# Altium schematic sheet MotorController_ControlV1.1.SchDoc
size 889 x 508 mm
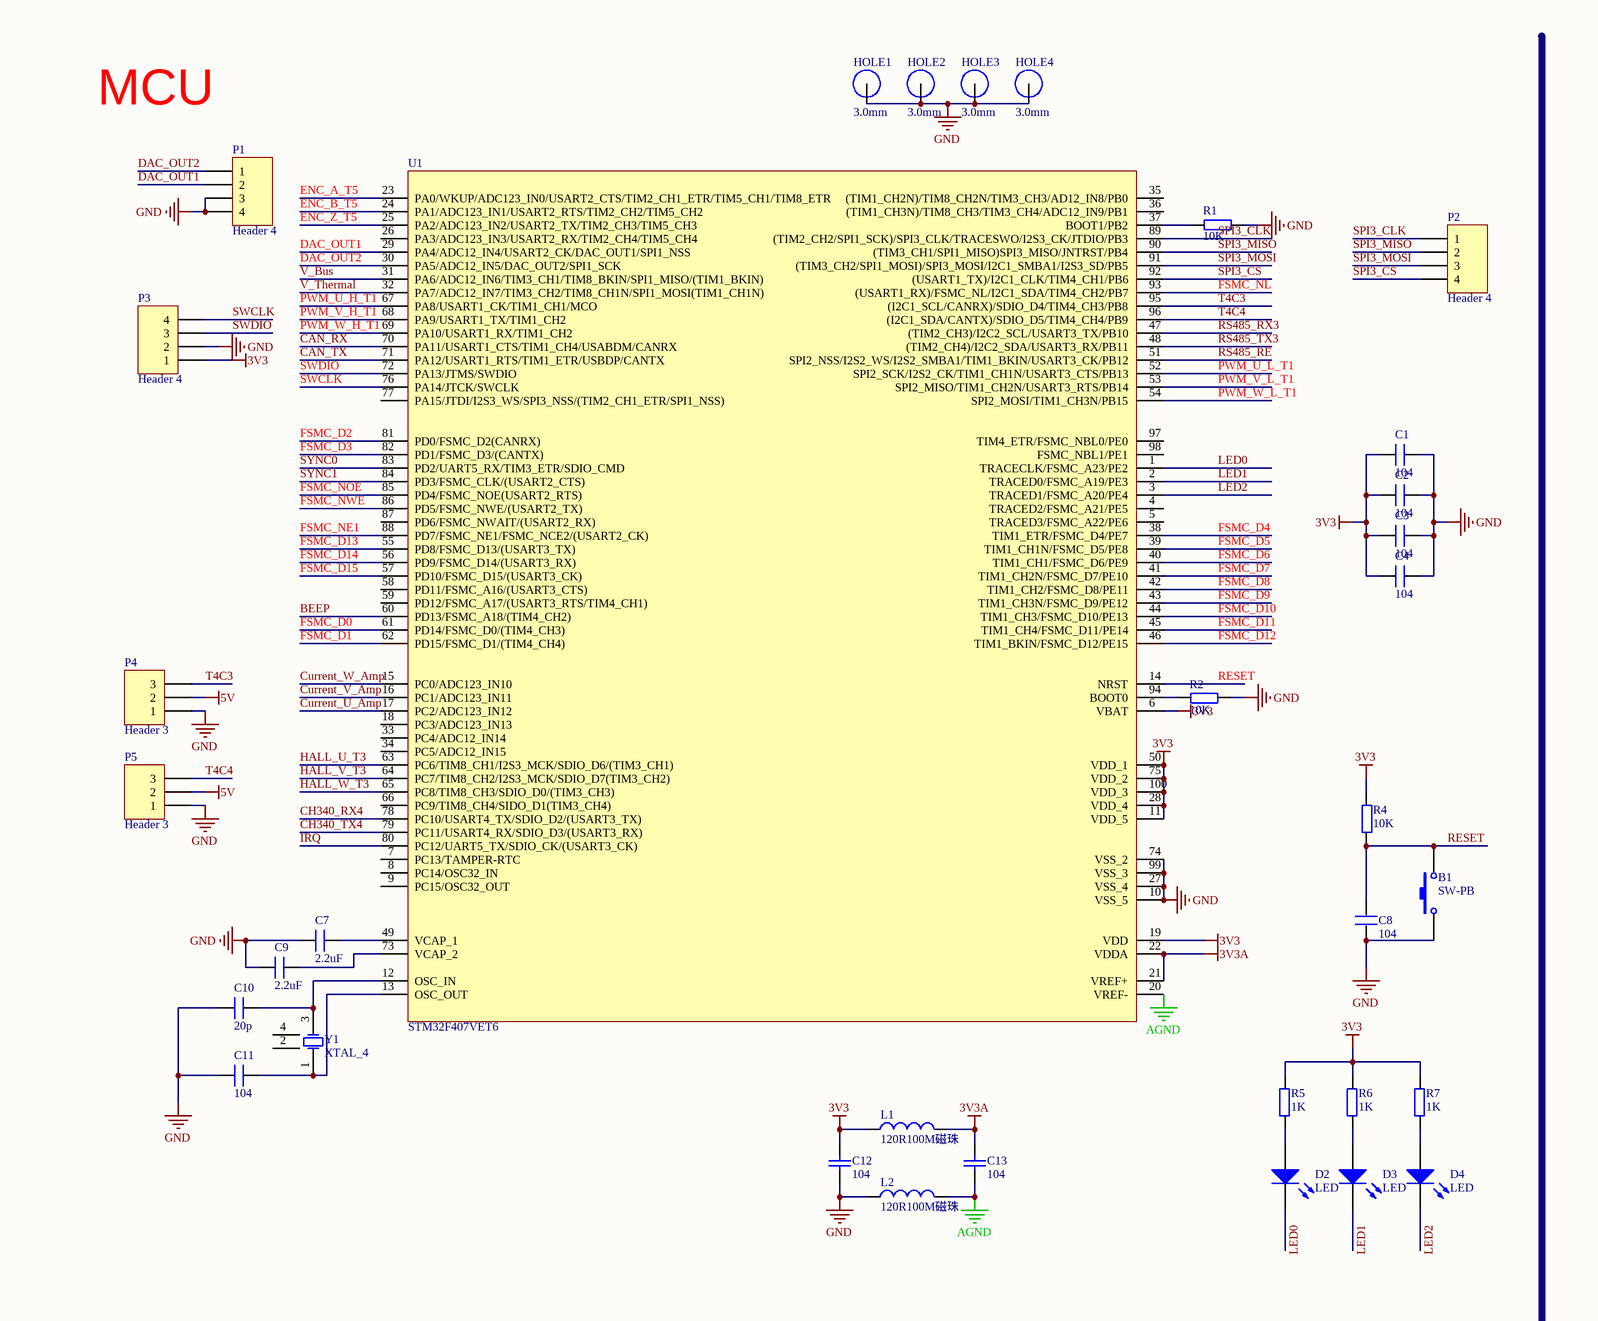
[diagram p0: MotorController_ControlV1.1.SchDoc, top left]
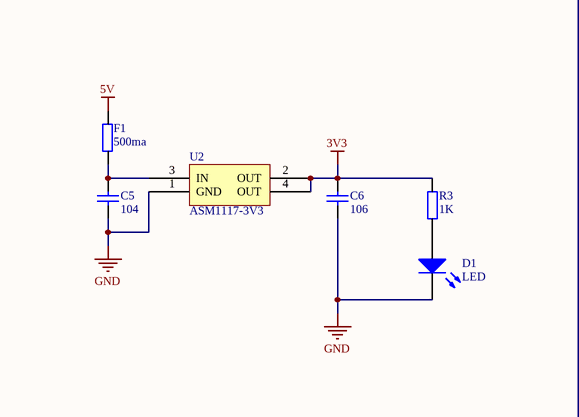
[diagram p1: MotorController_ControlV1.1.SchDoc, top middle]
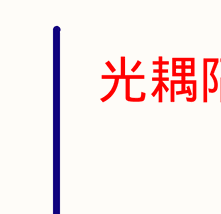
[diagram p2: MotorController_ControlV1.1.SchDoc, top right]
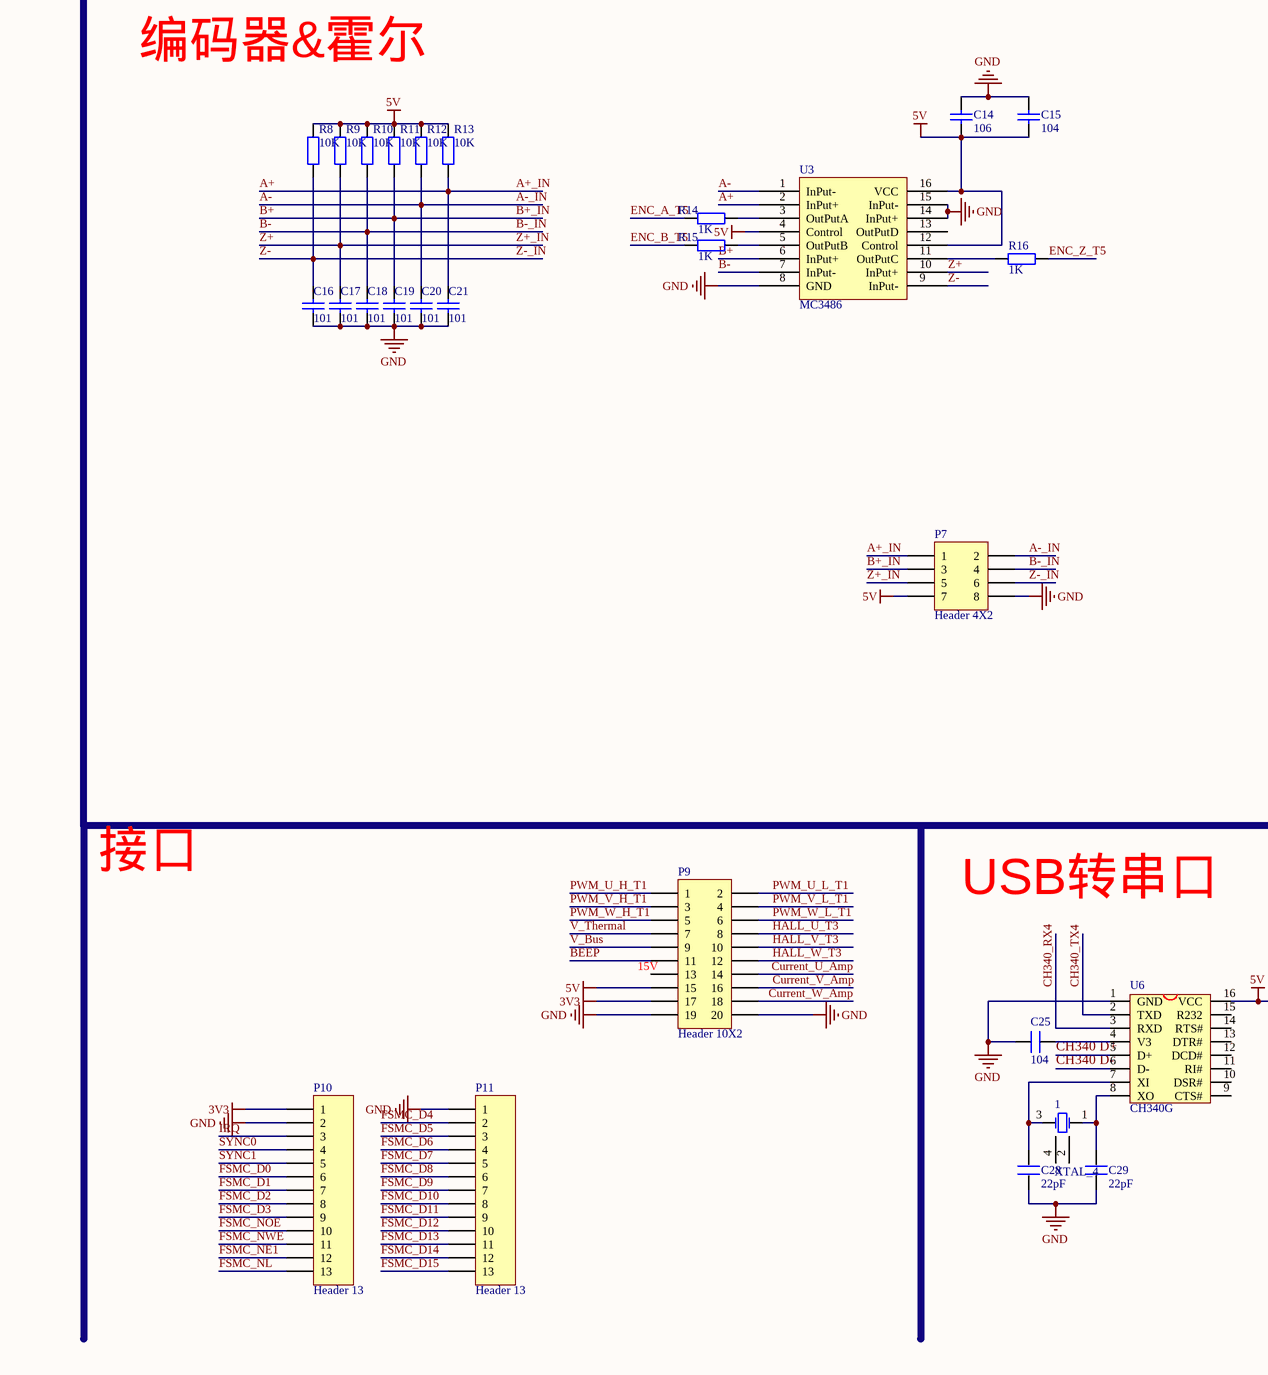
[diagram p3: MotorController_ControlV1.1.SchDoc, bottom middle]
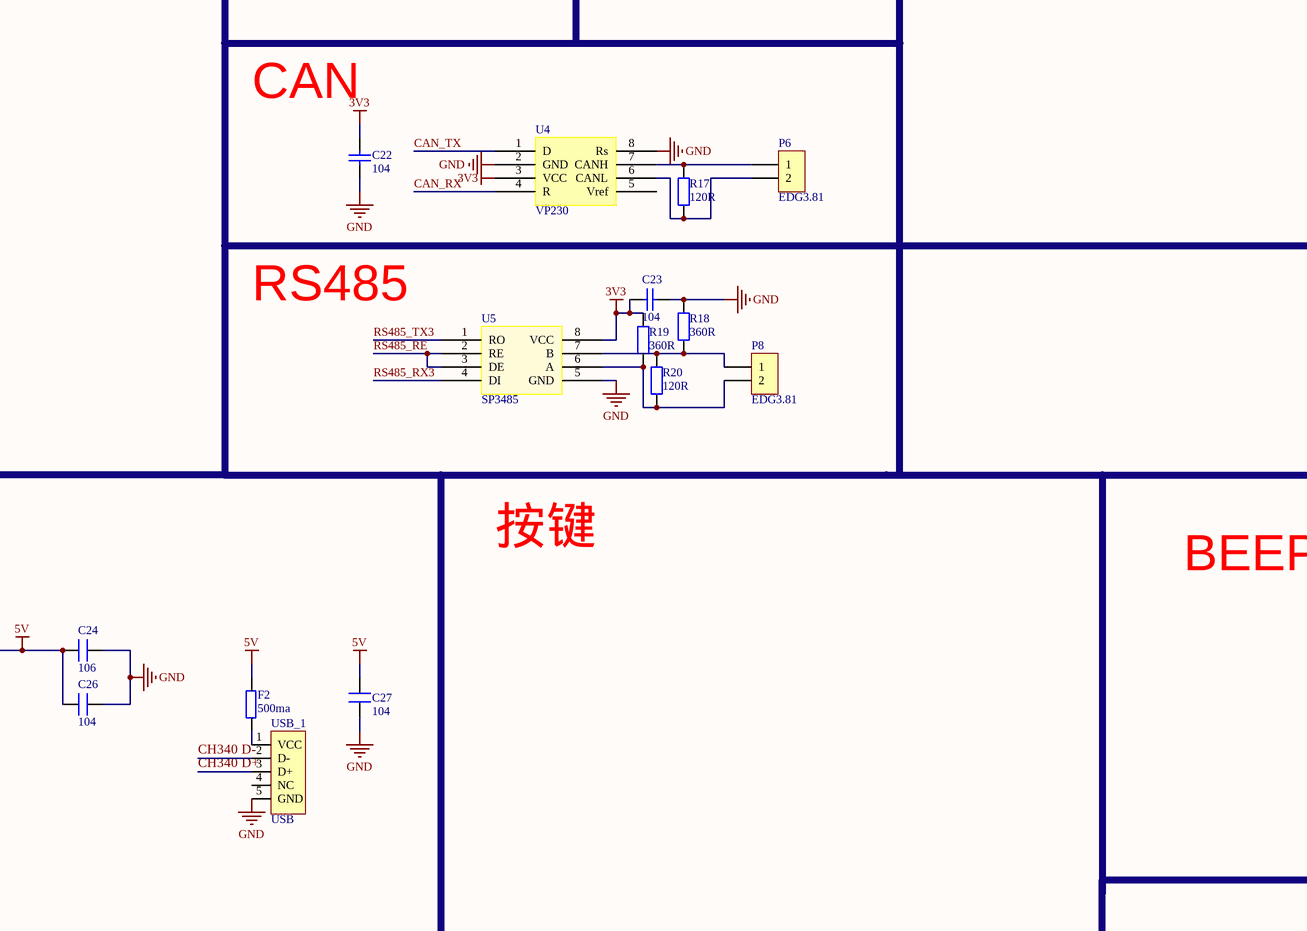
[diagram p4: MotorController_ControlV1.1.SchDoc, bottom right]

## Parts
1  XTAL_4  [OSC 3225-4P]
B1  SW-PB  [TSW DIP-3*6*5_V]
C1  104  [0603_C]
C2  104  [0603_C]
C3  104  [0603_C]
C4  104  [0603_C]
C5  104  [0603_C]
C6  106  [0603_C]
C7  2.2uF  [0603_C]
C8  104  [0603_C]
C9  2.2uF  [0603_C]
C10  20p  [0603_C]
C11  104  [0603_C]
C12  104  [0603_C]
C13  104  [0603_C]
C14  value 106  [0603_C]  (hidden comment: Cap)
C15  value 104  [0603_C]  (hidden comment: Cap)
C16  value 101  [0603_C]  (hidden comment: Cap)
C17  value 101  [0603_C]  (hidden comment: Cap)
C18  value 101  [0603_C]  (hidden comment: Cap)
C19  value 101  [0603_C]  (hidden comment: Cap)
C20  value 101  [0603_C]  (hidden comment: Cap)
C21  value 101  [0603_C]  (hidden comment: Cap)
C22  value 104  [0603_C]  (hidden comment: Cap)
C23  value 104  [0603_C]  (hidden comment: Cap)
C24  106  [0603_C]
C25  104  [0603_C]
C26  104  [0603_C]
C27  104  [0603_C]
C28  22pF  [0603_C]
C29  22pF  [0603_C]
D1  LED  [0603_LED]
D2  LED  [0603_LED]
D3  LED  [0603_LED]
D4  LED  [0603_LED]
F1  500ma  [FU 0805]
F2  500ma  [FU 0805]
HOLE1  value 3.0mm  [M2.5x6+6_L]  (hidden comment: HOLE)
HOLE2  value 3.0mm  [M2.5x6+6_L]  (hidden comment: HOLE)
HOLE3  value 3.0mm  [M2.5x6+6_L]  (hidden comment: HOLE)
HOLE4  value 3.0mm  [M2.5x6+6_L]  (hidden comment: HOLE)
L1  120R100M磁珠  [0603_R]
L2  120R100M磁珠  [0603_R]
P1  Header 4  [HDR2.54-LI-4P]
P2  Header 4  [HDR1X4]
P3  Header 4  [HDR1X4]
P4  Header 3  [HDR1X3]
P5  Header 3  [HDR1X3]
P6  EDG3.81  [3.81EDG_2*1W]
P7  Header 4X2  [HDR2.54-WI-2x4P]
P8  EDG3.81  [3.81EDG_2*1W]
P9  Header 10X2  [HDR2.54-LI-2x10P]
P10  Header 13  [HDR2.54-LI-13P]
P11  Header 13  [HDR2.54-LI-13P]
R1  10K  [0603_R]
R2  10K  [0603_R]
R3  1K  [0603_R]
R4  10K  [0603_R]
R5  1K  [0603_R]
R6  1K  [0603_R]
R7  1K  [0603_R]
R8  value 10K  [0603_R]  (hidden comment: Res2)
R9  value 10K  [0603_R]  (hidden comment: Res2)
R10  value 10K  [0603_R]  (hidden comment: Res2)
R11  value 10K  [0603_R]  (hidden comment: Res2)
R12  value 10K  [0603_R]  (hidden comment: Res2)
R13  value 10K  [0603_R]  (hidden comment: Res2)
R14  value 1K  [0603_R]  (hidden comment: Res2)
R15  value 1K  [0603_R]  (hidden comment: Res2)
R16  value 1K  [0603_R]  (hidden comment: Res2)
R17  value 120R  [0603_R]  (hidden comment: Res2)
R18  value 360R  [0603_R]  (hidden comment: Res2)
R19  value 360R  [0603_R]  (hidden comment: Res2)
R20  value 120R  [0603_R]  (hidden comment: Res2)
U1  STM32F407VET6  [LQFP-100_M]
U2  ASM1117-3V3  [SOT-223]
U3  MC3486  [SO-16N]
U4  VP230  [SOP-8]
U5  SP3485  [SOP-8]
U6  CH340G  [SOP16]
USB_1  USB  [USB_AB]
Y1  XTAL_4  [OSC 5032-4P]

## Nets
3V3: C1.2 C2.2 C3.2 C4.2 C6.2 C12.2 C22.2 C23.2 L1.1 P3.1 P9.17 P10.1 R3.2 R4.2 R5.1 R6.1 R7.1 R19.1 U1.6(VBAT) U1.11(VDD_5) U1.19(VDD) U1.28(VDD_4) U1.50(VDD_1) U1.75(VDD_2) U1.100(VDD_3) U2.2(OUT) U2.4(OUT) U4.3(VCC) U5.8(VCC)
3V3A: C13.2 L1.2 U1.21(VREF+) U1.22(VDDA)
5V: C14.1 C15.1 C24.1 C26.1 C27.2 F1.1 F2.1 P4.2 P5.2 P7.7 P9.15 R8.1 R9.1 R10.1 R11.1 R12.1 R13.1 U3.4(Control) U3.12(Control) U3.16(VCC) U6.16(VCC)
AGND: C13.1 L2.2 U1.20(VREF-)
GND: B1.1 C1.1 C2.1 C3.1 C4.1 C5.1 C6.1 C7.1 C8.1 C9.1 C10.1 C11.1 C12.1 C14.2 C15.2 C16.2 C17.2 C18.2 C19.2 C20.2 C21.2 C22.1 C23.1 C24.2 C25.1 C26.2 C27.1 C28.1 C29.1 D1.2(K) HOLE1.1 HOLE2.1 HOLE3.1 HOLE4.1 L2.1 P1.3 P1.4 P3.2 P4.1 P5.1 P7.8 P9.19 P9.20 P10.2 P11.1 R1.1 R2.2 R18.1 U1.10(VSS_5) U1.27(VSS_4) U1.74(VSS_2) U1.99(VSS_3) U2.1(GND) U3.8(GND) U3.14(InPut+) U3.15(InPut-) U4.2(GND) U4.8(Rs) U5.5(GND) U6.1(GND) USB_1.5(GND)
A+: C21.1 P7.1 R13.2 U3.2(InPut+)  [also labelled A+_IN]
A-: C20.1 P7.2 R12.2 U3.1(InPut-)  [also labelled A-_IN]
B+: C19.1 P7.3 R11.2 U3.6(InPut+)  [also labelled B+_IN]
B-: C18.1 P7.4 R10.2 U3.7(InPut-)  [also labelled B-_IN]
BEEP: P9.11 U1.60(PD13/FSMC_A18/(TIM4_CH2))
CAN_RX: U1.70(PA11/USART1_CTS/TIM1_CH4/USABDM/CANRX) U4.4(R)
CAN_TX: U1.71(PA12/USART1_RTS/TIM1_ETR/USBDP/CANTX) U4.1(D)
CH340 D+: U6.5(D+) USB_1.3(D+)
CH340 D-: U6.6(D-) USB_1.2(D-)
CH340_RX4: U1.78(PC10/USART4_TX/SDIO_D2/(USART3_TX)) U6.3(RXD)
CH340_TX4: U1.79(PC11/USART4_RX/SDIO_D3/(USART3_RX)) U6.2(TXD)
Current_U_Amp: P9.14 U1.17(PC2/ADC123_IN12)
Current_V_Amp: P9.16 U1.16(PC1/ADC123_IN11)
Current_W_Amp: P9.18 U1.15(PC0/ADC123_IN10)
DAC_OUT1: P1.2 U1.29(PA4/ADC12_IN4/USART2_CK/DAC_OUT1/SPI1_NSS)
DAC_OUT2: P1.1 U1.30(PA5/ADC12_IN5/DAC_OUT2/SPI1_SCK)
ENC_A_T5: R14.2 U1.23(PA0/WKUP/ADC123_IN0/USART2_CTS/TIM2_CH1_ETR/TIM5_CH1/TIM8_ETR)
ENC_B_T5: R15.2 U1.24(PA1/ADC123_IN1/USART2_RTS/TIM2_CH2/TIM5_CH2)
ENC_Z_T5: R16.2 U1.25(PA2/ADC123_IN2/USART2_TX/TIM2_CH3/TIM5_CH3)
FSMC_D0: P10.6 U1.61(PD14/FSMC_D0/(TIM4_CH3))
FSMC_D1: P10.7 U1.62(PD15/FSMC_D1/(TIM4_CH4))
FSMC_D2: P10.8 U1.81(PD0/FSMC_D2(CANRX))
FSMC_D3: P10.9 U1.82(PD1/FSMC_D3/(CANTX))
FSMC_D4: P11.2 U1.38(TIM1_ETR/FSMC_D4/PE7)
FSMC_D5: P11.3 U1.39(TIM1_CH1N/FSMC_D5/PE8)
FSMC_D6: P11.4 U1.40(TIM1_CH1/FSMC_D6/PE9)
FSMC_D7: P11.5 U1.41(TIM1_CH2N/FSMC_D7/PE10)
FSMC_D8: P11.6 U1.42(TIM1_CH2/FSMC_D8/PE11)
FSMC_D9: P11.7 U1.43(TIM1_CH3N/FSMC_D9/PE12)
FSMC_D10: P11.8 U1.44(TIM1_CH3/FSMC_D10/PE13)
FSMC_D11: P11.9 U1.45(TIM1_CH4/FSMC_D11/PE14)
FSMC_D12: P11.10 U1.46(TIM1_BKIN/FSMC_D12/PE15)
FSMC_D13: P11.11 U1.55(PD8/FSMC_D13/(USART3_TX))
FSMC_D14: P11.12 U1.56(PD9/FSMC_D14/(USART3_RX))
FSMC_D15: P11.13 U1.57(PD10/FSMC_D15/(USART3_CK))
FSMC_NE1: P10.12 U1.88(PD7/FSMC_NE1/FSMC_NCE2/(USART2_CK))
FSMC_NL: P10.13 U1.93((USART1_RX)/FSMC_NL/I2C1_SDA/TIM4_CH2/PB7)
FSMC_NOE: P10.10 U1.85(PD4/FSMC_NOE(USART2_RTS))
FSMC_NWE: P10.11 U1.86(PD5/FSMC_NWE/(USART2_TX))
HALL_U_T3: P9.8 U1.63(PC6/TIM8_CH1/I2S3_MCK/SDIO_D6/(TIM3_CH1))
HALL_V_T3: P9.10 U1.64(PC7/TIM8_CH2/I2S3_MCK/SDIO_D7(TIM3_CH2))
HALL_W_T3: P9.12 U1.65(PC8/TIM8_CH3/SDIO_D0/(TIM3_CH3))
IRQ: P10.3 U1.80(PC12/UART5_TX/SDIO_CK/(USART3_CK))
LED0: D2.2(K) U1.1(TRACECLK/FSMC_A23/PE2)
LED1: D3.2(K) U1.2(TRACED0/FSMC_A19/PE3)
LED2: D4.2(K) U1.3(TRACED1/FSMC_A20/PE4)
PWM_U_H_T1: P9.1 U1.67(PA8/USART1_CK/TIM1_CH1/MCO)
PWM_U_L_T1: P9.2 U1.52(SPI2_SCK/I2S2_CK/TIM1_CH1N/USART3_CTS/PB13)
PWM_V_H_T1: P9.3 U1.68(PA9/USART1_TX/TIM1_CH2)
PWM_V_L_T1: P9.4 U1.53(SPI2_MISO/TIM1_CH2N/USART3_RTS/PB14)
PWM_W_H_T1: P9.5 U1.69(PA10/USART1_RX/TIM1_CH2)
PWM_W_L_T1: P9.6 U1.54(SPI2_MOSI/TIM1_CH3N/PB15)
RESET: B1.2 C8.2 R4.1 U1.14(NRST)
RS485_RE: U1.51(SPI2_NSS/I2S2_WS/I2S2_SMBA1/TIM1_BKIN/USART3_CK/PB12) U5.2(RE) U5.3(DE)
RS485_RX3: U1.47((TIM2_CH3)/I2C2_SCL/USART3_TX/PB10) U5.4(DI)
RS485_TX3: U1.48((TIM2_CH4)/I2C2_SDA/USART3_RX/PB11) U5.1(RO)
SPI3_CLK: P2.1 U1.89((TIM2_CH2/SPI1_SCK)/SPI3_CLK/TRACESWO/I2S3_CK/JTDIO/PB3)
SPI3_CS: P2.4 U1.92((USART1_TX)/I2C1_CLK/TIM4_CH1/PB6)
SPI3_MISO: P2.2 U1.90((TIM3_CH1/SPI1_MISO)SPI3_MISO/JNTRST/PB4)
SPI3_MOSI: P2.3 U1.91((TIM3_CH2/SPI1_MOSI)/SPI3_MOSI/I2C1_SMBA1/I2S3_SD/PB5)
SWCLK: P3.4 U1.76(PA14/JTCK/SWCLK)
SWDIO: P3.3 U1.72(PA13/JTMS/SWDIO)
SYNC0: P10.4 U1.83(PD2/UART5_RX/TIM3_ETR/SDIO_CMD)
SYNC1: P10.5 U1.84(PD3/FSMC_CLK/(USART2_CTS))
T4C3: P4.3 U1.95((I2C1_SCL/CANRX)/SDIO_D4/TIM4_CH3/PB8)
T4C4: P5.3 U1.96((I2C1_SDA/CANTX)/SDIO_D5/TIM4_CH4/PB9)
V_Bus: P9.9 U1.31(PA6/ADC12_IN6/TIM3_CH1/TIM8_BKIN/SPI1_MISO/(TIM1_BKIN))
V_Thermal: P9.7 U1.32(PA7/ADC12_IN7/TIM3_CH2/TIM8_CH1N/SPI1_MOSI(TIM1_CH1N))
Z+: C17.1 P7.5 R9.2 U3.10(InPut+)  [also labelled Z+_IN]
Z-: C16.1 P7.6 R8.2 U3.9(InPut-)  [also labelled Z-_IN]
Net1_1: 1.1(OSC1) C29.2 U6.8(XO)
Net1_3: 1.3(OSC2) C28.2 U6.7(XI)
NetC5_2: C5.2 F1.2 U2.3(IN)
NetC7_2: C7.2 U1.49(VCAP_1)
NetC9_2: C9.2 U1.73(VCAP_2)
NetC10_2: C10.2 U1.12(OSC_IN) Y1.3(OSC2)
NetC11_2: C11.2 U1.13(OSC_OUT) Y1.1(OSC1)
NetC25_2: C25.2 U6.4(V3)
NetD1_1: D1.1(A) R3.1
NetD2_1: D2.1(A) R5.2
NetD3_1: D3.1(A) R6.2
NetD4_1: D4.1(A) R7.2
NetF2_2: F2.2 USB_1.1(VCC)
NetP6_1: P6.1 R17.1 U4.7(CANH)
NetP6_2: P6.2 R17.2 U4.6(CANL)
NetP8_1: P8.1 R18.2 R20.1 U5.7(B)
NetP8_2: P8.2 R19.2 R20.2 U5.6(A)
NetR1_2: R1.2 U1.37(BOOT1/PB2)
NetR2_1: R2.1 U1.94(BOOT0)
NetR14_1: R14.1 U3.3(OutPutA)
NetR15_1: R15.1 U3.5(OutPutB)
NetR16_1: R16.1 U3.11(OutPutC)

Not connected (* = marked no-connect by the designer): 1 2(OSC2) 4(OSC2); P9 13; U1 4(TRACED2/FSMC_A21/PE5) 5(TRACED3/FSMC_A22/PE6) 7(PC13/TAMPER-RTC) 8(PC14/OSC32_IN) 9(PC15/OSC32_OUT) 18(PC3/ADC123_IN13) 26(PA3/ADC123_IN3/USART2_RX/TIM2_CH4/TIM5_CH4) 33(PC4/ADC12_IN14) 34(PC5/ADC12_IN15) 35((TIM1_CH2N)/TIM8_CH2N/TIM3_CH3/AD12_IN8/PB0) 36((TIM1_CH3N)/TIM8_CH3/TIM3_CH4/ADC12_IN9/PB1) 58(PD11/FSMC_A16/(USART3_CTS)) 59(PD12/FSMC_A17/(USART3_RTS/TIM4_CH1)) 66(PC9/TIM8_CH4/SIDO_D1(TIM3_CH4)) 77(PA15/JTDI/I2S3_WS/SPI3_NSS/(TIM2_CH1_ETR/SPI1_NSS)) 87(PD6/FSMC_NWAIT/(USART2_RX)) 97(TIM4_ETR/FSMC_NBL0/PE0) 98(FSMC_NBL1/PE1); U3 13(OutPutD); U4 5(Vref); U6 9(CTS#) 10(DSR#) 11(RI#) 12(DCD#) 13(DTR#) 14(RTS#) 15(R232); USB_1 4(NC); Y1 2(OSC2) 4(OSC2)

## Notes on the sheet
- MCU
- 光耦隔离
- 编码器&霍尔
- (near C22) CAN
- RS485
- 接口
- USB转串口
- 按键
- (near P9) 15V
- BEEP

## Library data of the parts
1 Y1 = XTAL_4: Crystal Oscillator; Published: 8-Jun-2000; LatestRevisionDate: 17-Jul-2002; LatestRevisionNote: Re-released for DXP Platform.; PackageReference: R38; Publisher: Altium Limited; PackageDescription: Crystal, Thru-Hole; 2 Leads; Body 3.1 x 8.2 mm (Dia.xH)
B1 = SW-PB: Switch; Published: 24-Mar-1999; LatestRevisionDate: 17-Jul-2002; LatestRevisionNote: Re-released for DXP Platform.; PackageReference: SPST-2; Publisher: Altium Limited; PackageDescription: Switch; 2 Leads
C1-C4 C7-C11 C24-C29 = C
C5 C6 C12 C13 = C: Value: 100pF; Published: 8-Jun-2000; LatestRevisionDate: 29-May-2009; LatestRevisionNote: IPC-7351 Footprint Added.; PackageReference: C1206; Publisher: Altium Limited; PackageDescription: Chip Capacitor
C14-C23 = Cap: Capacitor; Published: 8-Jun-2000; LatestRevisionDate: 17-Jul-2002; LatestRevisionNote: Re-released for DXP Platform.; PackageReference: RAD-0.3; Publisher: Altium Limited; PackageDescription: Radial Cap, Thru-Hole; 2 Leads; 0.3 in Pin Spacing
F1 F2 R1-R7 = R
L1 L2 = L_1: L; Code_IEC: 1005; Value: 10mH; Published: 8-Jun-2000; LatestRevisionDate: 29-May-2009; LatestRevisionNote: IPC-7351 Footprint Added.; PackageReference: 0402-A; Publisher: Altium Limited; PackageDescription: Chip Inductor; Code_JEITA: 0402
P1-P3 = Header 4: Header, 4-Pin; LatestRevisionDate: 17-Jul-2002; LatestRevisionNote: Re-released for DXP Platform.; Publisher: Altium Limited
P4 P5 = Header 3: Header, 3-Pin; LatestRevisionDate: 17-Jul-2002; LatestRevisionNote: Re-released for DXP Platform.; Publisher: Altium Limited
P6 = HT3.96: LatestRevisionDate: 17-Jul-2002; LatestRevisionNote: Re-released for DXP Platform.; Publisher: Altium Limited
P7 = Header 4X2: Header, 4-Pin, Dual row; LatestRevisionDate: 17-Jul-2002; LatestRevisionNote: Re-released for DXP Platform.; Publisher: Altium Limited
P8 = HT3.96: pin to pad: 1>2 2>1; LatestRevisionDate: 17-Jul-2002; LatestRevisionNote: Re-released for DXP Platform.; Publisher: Altium Limited
P9 = Header 10X2: Header, 10-Pin, Dual row; LatestRevisionDate: 17-Jul-2002; LatestRevisionNote: Re-released for DXP Platform.; Publisher: Altium Limited
P10 P11 = Header 13: Header, 13-Pin; LatestRevisionDate: 17-Jul-2002; LatestRevisionNote: Re-released for DXP Platform.; Publisher: Altium Limited
R8-R20 = Res2: Resistor; Published: 8-Jun-2000; LatestRevisionDate: 17-Jul-2002; LatestRevisionNote: Re-released for DXP Platform.; PackageReference: AXIAL-0.4; Publisher: Altium Limited; PackageDescription: Axial Device, Thru-Hole; 2 Leads; 0.4 in Pin Spacing
U2 = ASM1117: 3.3V稳压芯片
U3 = Component_1
U6 = CH340G: USB2UART
USB_1 = USB5